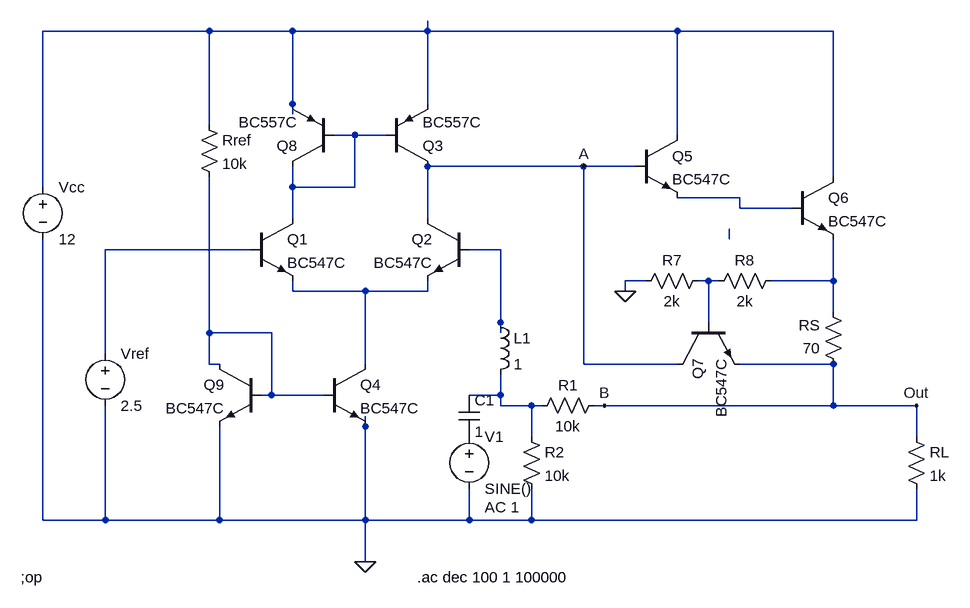
[diagram p0: schematic ParteLineal.asc]
ParteLineal.asc, the LTspice schematic file:
Version 4
SHEET 1 1172 680
WIRE 32 -176 -224 -176
WIRE 160 -176 32 -176
WIRE 368 -176 368 -192
WIRE 368 -176 160 -176
WIRE 752 -176 368 -176
WIRE 992 -176 752 -176
WIRE 160 -64 160 -176
WIRE 368 -64 368 -176
WIRE 160 -48 160 -64
WIRE 32 -32 32 -176
WIRE 256 -16 224 -16
WIRE 304 -16 256 -16
WIRE 752 -16 752 -176
WIRE 608 32 368 32
WIRE 688 32 608 32
WIRE 992 48 992 -176
WIRE -224 64 -224 -176
WIRE 160 64 160 32
WIRE 256 64 256 -16
WIRE 256 64 160 64
WIRE 848 80 752 80
WIRE 848 96 848 80
WIRE 928 96 848 96
WIRE 160 112 160 64
WIRE 368 112 368 32
WIRE 832 144 832 128
WIRE 96 160 -128 160
WIRE 480 160 432 160
WIRE 704 208 672 208
WIRE 800 208 784 208
WIRE 816 208 800 208
WIRE 992 208 992 144
WIRE 992 208 896 208
WIRE 160 224 160 208
WIRE 272 224 160 224
WIRE 368 224 368 208
WIRE 368 224 272 224
WIRE 672 224 672 208
WIRE 992 256 992 208
WIRE 480 272 480 160
WIRE 800 272 800 208
WIRE 32 288 32 48
WIRE 128 288 32 288
WIRE 480 288 480 272
WIRE -128 320 -128 160
WIRE 32 336 32 288
WIRE 48 336 32 336
WIRE 272 336 272 224
WIRE 608 336 608 32
WIRE 752 336 608 336
WIRE 992 336 848 336
WIRE 128 384 128 288
WIRE 128 384 112 384
WIRE 208 384 128 384
WIRE 480 384 480 352
WIRE 480 384 432 384
WIRE 480 400 480 384
WIRE 528 400 480 400
WIRE 544 400 528 400
WIRE 640 400 624 400
WIRE 992 400 992 336
WIRE 992 400 640 400
WIRE 1120 400 992 400
WIRE 272 432 272 416
WIRE 528 448 528 400
WIRE 1120 448 1120 400
WIRE -224 576 -224 144
WIRE -128 576 -128 400
WIRE -128 576 -224 576
WIRE 48 576 48 432
WIRE 48 576 -128 576
WIRE 272 576 272 432
WIRE 272 576 48 576
WIRE 432 576 432 528
WIRE 432 576 272 576
WIRE 528 576 528 528
WIRE 528 576 432 576
WIRE 1120 576 1120 528
WIRE 1120 576 528 576
WIRE 272 640 272 576
FLAG 672 224 0
FLAG 272 640 0
FLAG 1120 400 Out
FLAG 608 32 A
FLAG 640 400 B
DATAFLAG 992 400 ""
DATAFLAG 992 400 ""
DATAFLAG 480 384 ""
DATAFLAG 480 384 ""
DATAFLAG 480 224 ""
SYMBOL npn 96 112 R0
SYMATTR InstName Q1
SYMATTR Value BC547C
SYMBOL npn 432 112 M0
SYMATTR InstName Q2
SYMATTR Value BC547C
SYMBOL npn 688 -16 R0
SYMATTR InstName Q5
SYMATTR Value BC547C
SYMBOL npn 928 48 R0
SYMATTR InstName Q6
SYMATTR Value BC547C
SYMBOL npn 752 272 M90
SYMATTR InstName Q7
SYMATTR Value BC547C
SYMBOL res 1008 352 R180
WINDOW 0 36 76 Left 2
WINDOW 3 36 40 Left 2
SYMATTR InstName RS
SYMATTR Value 70
SYMBOL res 1104 432 R0
SYMATTR InstName RL
SYMATTR Value 1k
SYMBOL res 512 432 R0
SYMATTR InstName R2
SYMATTR Value 10k
SYMBOL res 640 384 R90
WINDOW 0 0 56 VBottom 2
WINDOW 3 32 56 VTop 2
SYMATTR InstName R1
SYMATTR Value 10k
SYMBOL res 800 192 R90
WINDOW 0 0 56 VBottom 2
WINDOW 3 32 56 VTop 2
SYMATTR InstName R7
SYMATTR Value 2k
SYMBOL res 912 192 R90
WINDOW 0 0 56 VBottom 2
WINDOW 3 32 56 VTop 2
SYMATTR InstName R8
SYMATTR Value 2k
SYMBOL voltage -224 48 R0
SYMATTR InstName Vcc
SYMATTR Value 12
SYMBOL pnp 224 32 R180
SYMATTR InstName Q8
SYMATTR Value BC557C
SYMBOL pnp 304 32 M180
SYMATTR InstName Q3
SYMATTR Value BC557C
SYMBOL voltage -128 304 R0
WINDOW 123 0 0 Left 0
WINDOW 39 0 0 Left 0
SYMATTR InstName Vref
SYMATTR Value 2.5
SYMBOL npn 208 336 R0
SYMATTR InstName Q4
SYMATTR Value BC547C
SYMBOL npn 112 336 M0
SYMATTR InstName Q9
SYMATTR Value BC547C
SYMBOL res 16 -48 R0
SYMATTR InstName Rref
SYMATTR Value 10k
SYMBOL voltage 432 432 R0
WINDOW 123 24 124 Left 2
WINDOW 39 0 0 Left 0
SYMATTR InstName V1
SYMATTR Value SINE()
SYMATTR Value2 AC 1
SYMBOL ind 464 256 R0
SYMATTR InstName L1
SYMATTR Value 1
SYMBOL cap 416 384 R0
SYMATTR InstName C1
SYMATTR Value 1
TEXT -258 664 Left 2 !;op
TEXT 352 664 Left 2 !.ac dec 100 1 100000

The netlist it stands for:
* ParteLineal.asc
Q1 N002 N005 N009 0 BC547C
Q2 A N006 N009 0 BC547C
Q5 N001 A N003 0 BC547C
Q6 N001 N003 N008 0 BC547C
Q7 A N007 B 0 BC547C
RS B N008 70
RL B 0 1k
R2 N011 0 10k
R1 B N011 10k
R7 N007 0 2k
R8 N008 N007 2k
Vcc N001 0 12
Q8 N002 N002 N001 0 BC557C
Q3 A N002 N001 0 BC557C
Vref N005 0 2.5
Q4 N009 N010 0 0 BC547C
Q9 N010 N010 0 0 BC547C
Rref N001 N010 10k
V1 P001 0 SINE() AC 1
L1 N006 N011 1
C1 N011 P001 1
.model NPN NPN
.model PNP PNP
.lib standard.bjt
;op
.ac dec 100 1 100000
.backanno
.end